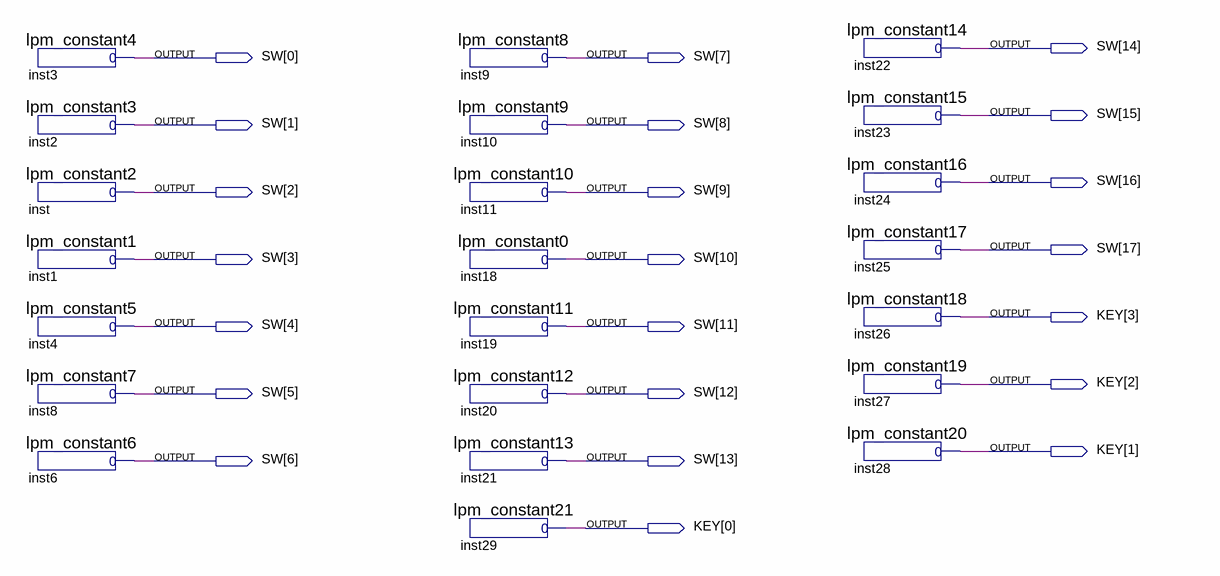
[diagram p0: schematic sheet]
// Quartus schematic bloco_virtual.bdf as structural Verilog: 22 symbols, 22 pins
module bloco_virtual (
  output [17:0] SW,
  output [3:0] KEY
);

  lpm_constant4 inst3 (.result(SW[0]));
  lpm_constant3 inst2 (.result(SW[1]));
  lpm_constant2 inst (.result(SW[2]));
  lpm_constant1 inst1 (.result(SW[3]));
  lpm_constant5 inst4 (.result(SW[4]));
  lpm_constant7 inst8 (.result(SW[5]));
  lpm_constant6 inst6 (.result(SW[6]));
  lpm_constant8 inst9 (.result(SW[7]));
  lpm_constant9 inst10 (.result(SW[8]));
  lpm_constant10 inst11 (.result(SW[9]));
  lpm_constant0 inst18 (.result(SW[10]));
  lpm_constant11 inst19 (.result(SW[11]));
  lpm_constant12 inst20 (.result(SW[12]));
  lpm_constant13 inst21 (.result(SW[13]));
  lpm_constant21 inst29 (.result(KEY[0]));
  lpm_constant14 inst22 (.result(SW[14]));
  lpm_constant15 inst23 (.result(SW[15]));
  lpm_constant16 inst24 (.result(SW[16]));
  lpm_constant17 inst25 (.result(SW[17]));
  lpm_constant18 inst26 (.result(KEY[3]));
  lpm_constant19 inst27 (.result(KEY[2]));
  lpm_constant20 inst28 (.result(KEY[1]));
endmodule
